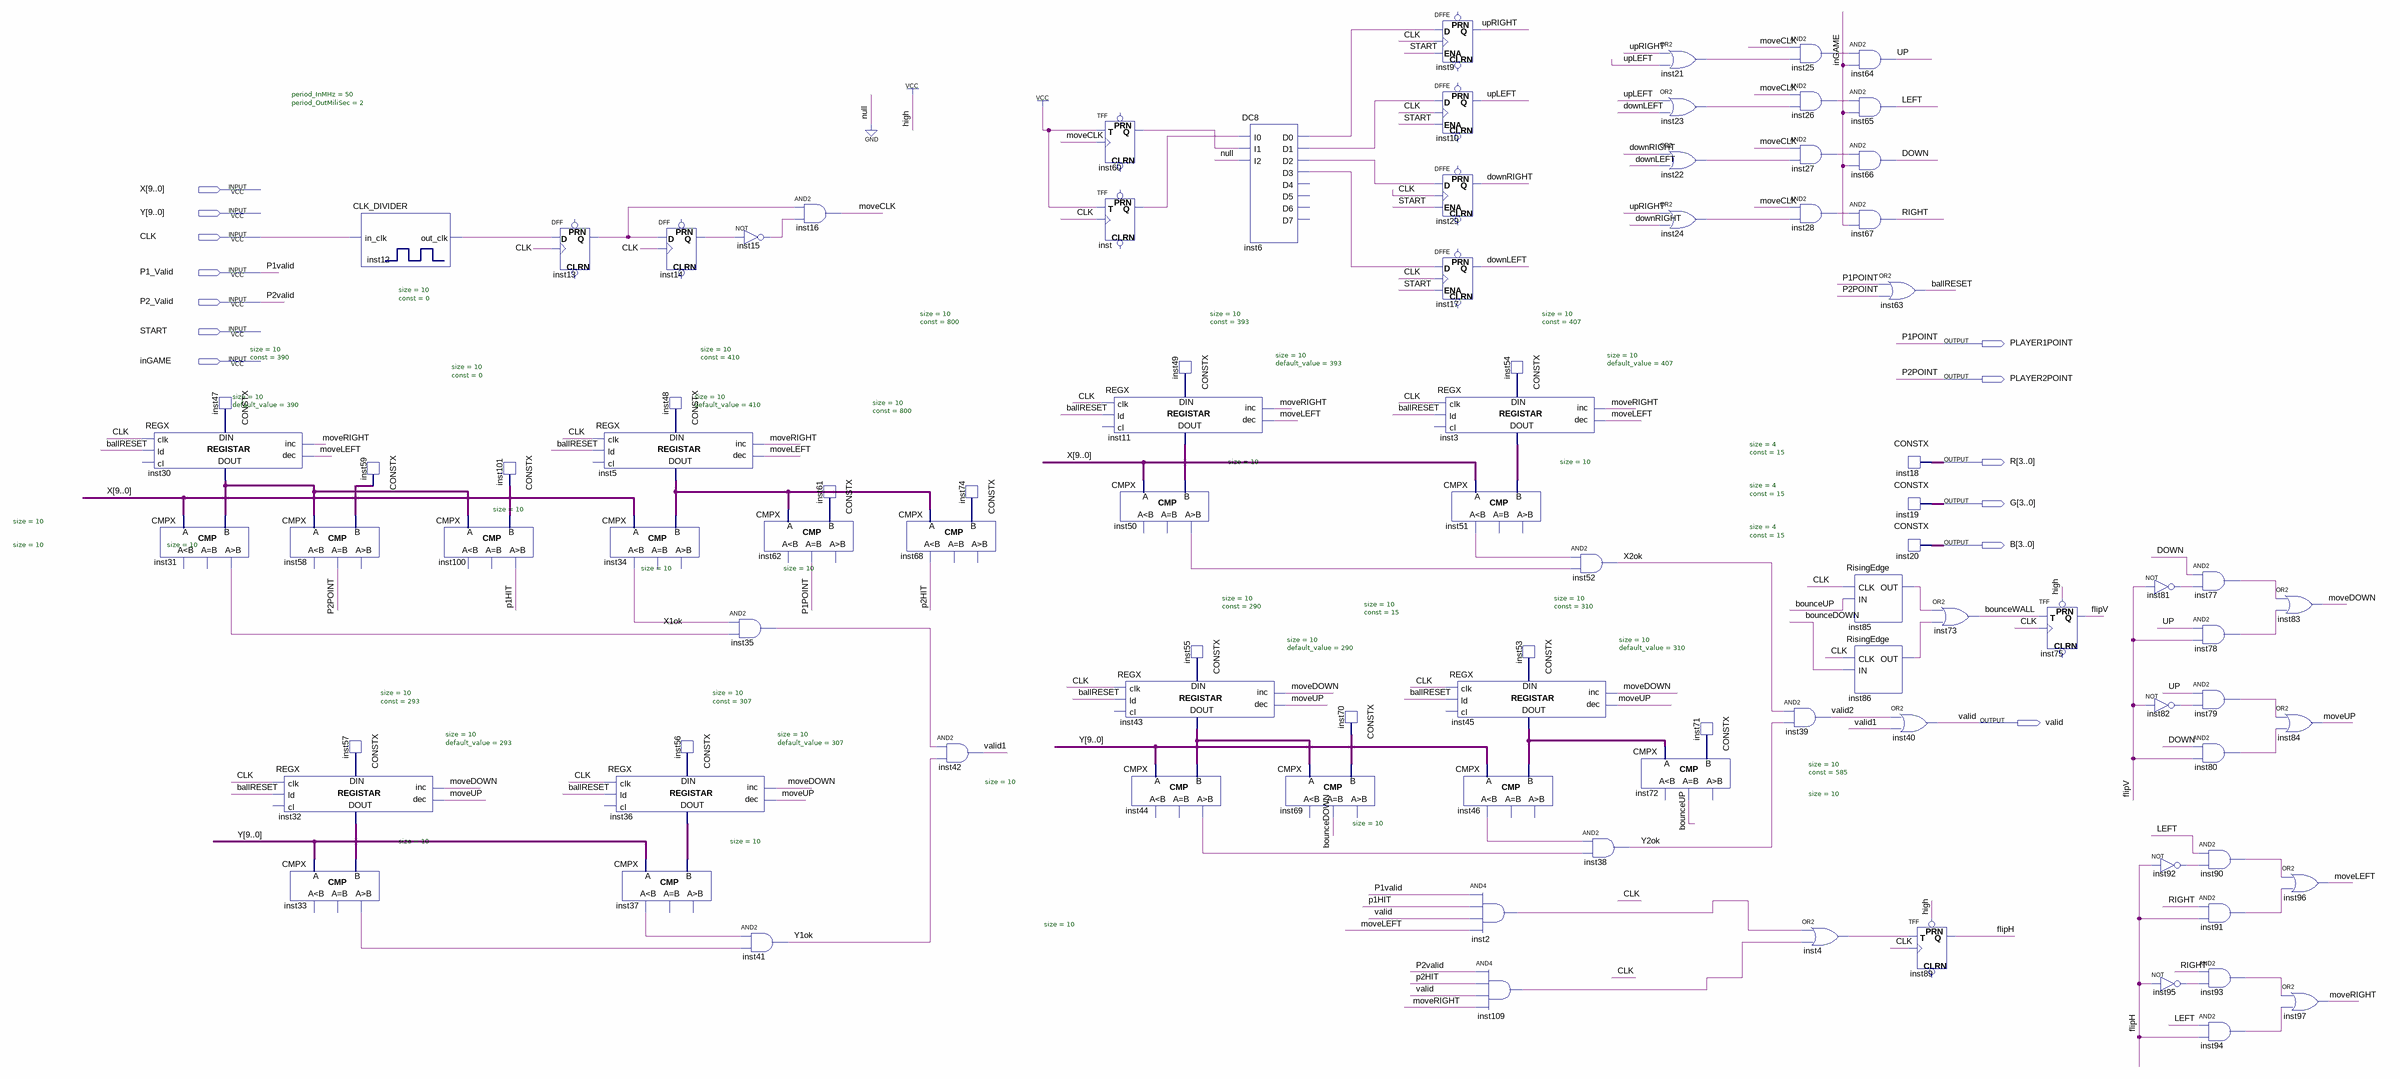
[diagram p0: schematic sheet]
// Quartus schematic Ball.bdf as structural Verilog: 95 symbols, 13 pins
module Ball (
  input  [9:0] X,
  input  [9:0] Y,
  input  CLK,
  input  P1_Valid,
  input  P2_Valid,
  input  START,
  input  inGAME,
  output PLAYER1POINT,
  output PLAYER2POINT,
  output [3:0] R,
  output [3:0] G,
  output [3:0] B,
  output valid
);

  wire ballRESET, bounceDOWN, bounceUP, bounceWALL, DOWN, downLEFT, downRIGHT, flipH, flipV, inst2_out,
       inst4_out, inst6_d0, inst6_d1, inst6_d2, inst6_d3, inst12_out_clk, inst13_q, inst14_q, inst15_out,
       inst21_out, inst22_out, inst23_out, inst24_out, inst25_out, inst26_out, inst27_out, inst28_out,
       inst31_gr, inst33_gr, inst34_ls, inst37_ls, inst44_gr, inst46_ls, inst50_gr, inst51_ls, inst60_q,
       inst77_out, inst78_out, inst79_out, inst80_out, inst81_out, inst82_out, inst85_out, inst86_out,
       inst90_out, inst91_out, inst92_out, inst93_out, inst94_out, inst95_out, inst109_out, inst_q, LEFT,
       moveCLK, moveDOWN, moveLEFT, moveRIGHT, moveUP, p1HIT, p2HIT, RIGHT, UP, upLEFT, upRIGHT, valid1,
       valid2, X1ok, X2ok, Y1ok, Y2ok;
  wire [9:0] inst3_data_out, inst5_data_out, inst11_data_out, inst30_data_out, inst32_data_out,
       inst36_data_out, inst43_data_out, inst45_data_out, inst47_data, inst48_data, inst49_data, inst53_data,
       inst54_data, inst55_data, inst56_data, inst57_data, inst59_data, inst61_data, inst70_data,
       inst71_data, inst74_data, inst101_data;

  REGX #(.size(10), .default_value(390)) inst30 (
    .clk(CLK), .ld(ballRESET), .inc(moveRIGHT), .dec(moveLEFT), .data_in(inst47_data),
    .data_out(inst30_data_out));  // open: cl
  CMPX #(.size(10)) inst31 (.A(X), .B(inst30_data_out), .gr(inst31_gr));  // open: ls, eq
  CONSTX #(.size(10), .\const (390)) inst47 (.data(inst47_data));
  CMPX #(.size(10)) inst58 (.A(inst30_data_out), .B(inst59_data), .eq(PLAYER2POINT));  // open: ls, gr
  REGX #(.size(10), .default_value(293)) inst32 (
    .clk(CLK), .ld(ballRESET), .inc(moveDOWN), .dec(moveUP), .data_in(inst57_data), .data_out(inst32_data_out));  // open: cl
  CMPX #(.size(10)) inst33 (.A(Y), .B(inst32_data_out), .gr(inst33_gr));  // open: ls, eq
  CLK_DIVIDER #(.period_InMHz(50), .period_OutMiliSec(2)) inst12 (.in_clk(CLK), .out_clk(inst12_out_clk));
  CONSTX #(.size(10), .\const (293)) inst57 (.data(inst57_data));
  CONSTX #(.size(10), .\const (0)) inst59 (.data(inst59_data));
  CMPX #(.size(10)) inst100 (.A(inst30_data_out), .B(inst101_data), .gr(p1HIT));  // open: ls, eq
  CONSTX #(.size(10), .\const (0)) inst101 (.data(inst101_data));
  DFF inst13 (.CLK(CLK), .D(inst12_out_clk), .Q(inst13_q));  // open: CLRN, PRN
  REGX #(.size(10), .default_value(410)) inst5 (
    .clk(CLK), .ld(ballRESET), .inc(moveRIGHT), .dec(moveLEFT), .data_in(inst48_data),
    .data_out(inst5_data_out));  // open: cl
  CMPX #(.size(10)) inst34 (.A(X), .B(inst5_data_out), .ls(inst34_ls));  // open: eq, gr
  REGX #(.size(10), .default_value(307)) inst36 (
    .clk(CLK), .ld(ballRESET), .inc(moveDOWN), .dec(moveUP), .data_in(inst56_data), .data_out(inst36_data_out));  // open: cl
  CMPX #(.size(10)) inst37 (.A(Y), .B(inst36_data_out), .ls(inst37_ls));  // open: eq, gr
  DFF inst14 (.CLK(CLK), .D(inst13_q), .Q(inst14_q));  // open: CLRN, PRN
  CONSTX #(.size(10), .\const (410)) inst48 (.data(inst48_data));
  CONSTX #(.size(10), .\const (307)) inst56 (.data(inst56_data));
  and inst35 (X1ok, inst34_ls, inst31_gr);
  not inst15 (inst15_out, inst14_q);
  CMPX #(.size(10)) inst62 (.A(inst5_data_out), .B(inst61_data), .eq(PLAYER1POINT));  // open: ls, gr
  and inst41 (Y1ok, inst37_ls, inst33_gr);
  and inst16 (moveCLK, inst13_q, inst15_out);
  CONSTX #(.size(10), .\const (800)) inst61 (.data(inst61_data));
  CMPX #(.size(10)) inst68 (.A(inst5_data_out), .B(inst74_data), .ls(p2HIT));  // open: eq, gr
  CONSTX #(.size(10), .\const (800)) inst74 (.data(inst74_data));
  and inst42 (valid1, X1ok, Y1ok);
  TFF inst60 (.T(1'b1), .CLK(moveCLK), .Q(inst60_q));  // open: PRN, CLRN
  TFF inst (.T(1'b1), .CLK(CLK), .Q(inst_q));  // open: PRN, CLRN
  REGX #(.size(10), .default_value(393)) inst11 (
    .clk(CLK), .ld(ballRESET), .inc(moveRIGHT), .dec(moveLEFT), .data_in(inst49_data),
    .data_out(inst11_data_out));  // open: cl
  CMPX #(.size(10)) inst50 (.A(X), .B(inst11_data_out), .gr(inst50_gr));  // open: ls, eq
  REGX #(.size(10), .default_value(290)) inst43 (
    .clk(CLK), .ld(ballRESET), .inc(moveDOWN), .dec(moveUP), .data_in(inst55_data), .data_out(inst43_data_out));  // open: cl
  CMPX #(.size(10)) inst44 (.A(Y), .B(inst43_data_out), .gr(inst44_gr));  // open: ls, eq
  CONSTX #(.size(10), .\const (393)) inst49 (.data(inst49_data));
  CONSTX #(.size(10), .\const (290)) inst55 (.data(inst55_data));
  DC8 inst6 (
    .I0(inst_q), .I1(inst60_q), .I2(1'b0), .D0(inst6_d0), .D1(inst6_d1), .D2(inst6_d2), .D3(inst6_d3));  // open: D4, D5, D6, D7
  CMPX #(.size(10)) inst69 (.A(inst43_data_out), .B(inst70_data), .eq(bounceDOWN));  // open: ls, gr
  CONSTX #(.size(10), .\const (15)) inst70 (.data(inst70_data));
  DFFE inst9 (.D(inst6_d0), .CLK(CLK), .ENA(START), .Q(upRIGHT));  // open: PRN, CLRN
  DFFE inst10 (.D(inst6_d1), .CLK(CLK), .ENA(START), .Q(upLEFT));  // open: PRN, CLRN
  DFFE inst29 (.D(inst6_d2), .CLK(CLK), .ENA(START), .Q(downRIGHT));  // open: PRN, CLRN
  DFFE inst17 (.D(inst6_d3), .CLK(CLK), .ENA(START), .Q(downLEFT));  // open: PRN, CLRN
  REGX #(.size(10), .default_value(407)) inst3 (
    .clk(CLK), .ld(ballRESET), .inc(moveRIGHT), .dec(moveLEFT), .data_in(inst54_data),
    .data_out(inst3_data_out));  // open: cl
  CMPX #(.size(10)) inst51 (.A(X), .B(inst3_data_out), .ls(inst51_ls));  // open: eq, gr
  REGX #(.size(10), .default_value(310)) inst45 (
    .clk(CLK), .ld(ballRESET), .inc(moveDOWN), .dec(moveUP), .data_in(inst53_data), .data_out(inst45_data_out));  // open: cl
  CMPX #(.size(10)) inst46 (.A(Y), .B(inst45_data_out), .ls(inst46_ls));  // open: eq, gr
  and inst2 (inst2_out, P1_Valid, p1HIT, valid, moveLEFT);
  and inst109 (inst109_out, P2_Valid, p2HIT, valid, moveRIGHT);
  CONSTX #(.size(10), .\const (407)) inst54 (.data(inst54_data));
  CONSTX #(.size(10), .\const (310)) inst53 (.data(inst53_data));
  and inst52 (X2ok, inst51_ls, inst50_gr);
  and inst38 (Y2ok, inst46_ls, inst44_gr);
  CMPX #(.size(10)) inst72 (.A(inst45_data_out), .B(inst71_data), .eq(bounceUP));  // open: ls, gr
  or inst21 (inst21_out, upRIGHT, upLEFT);
  or inst23 (inst23_out, upLEFT, downLEFT);
  or inst22 (inst22_out, downRIGHT, downLEFT);
  or inst24 (inst24_out, upRIGHT, downRIGHT);
  CONSTX #(.size(10), .\const (585)) inst71 (.data(inst71_data));
  and inst25 (inst25_out, moveCLK, inst21_out);
  and inst26 (inst26_out, moveCLK, inst23_out);
  and inst27 (inst27_out, moveCLK, inst22_out);
  and inst28 (inst28_out, moveCLK, inst24_out);
  and inst39 (valid2, X2ok, Y2ok);
  or inst4 (inst4_out, inst2_out, inst109_out);
  and inst64 (UP, inst25_out, inGAME);
  and inst65 (LEFT, inst26_out, inGAME);
  and inst66 (DOWN, inst27_out, inGAME);
  and inst67 (RIGHT, inst28_out, inGAME);
  RisingEdge inst85 (.CLK(CLK), .IN(bounceUP), .OUT(inst85_out));
  RisingEdge inst86 (.CLK(CLK), .IN(bounceDOWN), .OUT(inst86_out));
  or inst63 (ballRESET, PLAYER1POINT, PLAYER2POINT);
  CONSTX #(.size(4), .\const (15)) inst18 (.data(R));
  CONSTX #(.size(4), .\const (15)) inst19 (.data(G));
  CONSTX #(.size(4), .\const (15)) inst20 (.data(B));
  or inst40 (valid, valid2, valid1);
  TFF inst89 (.PRN(1'b1), .T(inst4_out), .CLK(CLK), .Q(flipH));  // open: CLRN
  or inst73 (bounceWALL, inst85_out, inst86_out);
  TFF inst75 (.PRN(1'b1), .T(bounceWALL), .CLK(CLK), .Q(flipV));  // open: CLRN
  not inst81 (inst81_out, flipV);
  not inst82 (inst82_out, flipV);
  not inst92 (inst92_out, flipH);
  not inst95 (inst95_out, flipH);
  and inst77 (inst77_out, DOWN, inst81_out);
  and inst78 (inst78_out, UP, flipV);
  and inst79 (inst79_out, UP, inst82_out);
  and inst80 (inst80_out, DOWN, flipV);
  and inst90 (inst90_out, LEFT, inst92_out);
  and inst91 (inst91_out, RIGHT, flipH);
  and inst93 (inst93_out, RIGHT, inst95_out);
  and inst94 (inst94_out, LEFT, flipH);
  or inst83 (moveDOWN, inst77_out, inst78_out);
  or inst84 (moveUP, inst79_out, inst80_out);
  or inst96 (moveLEFT, inst90_out, inst91_out);
  or inst97 (moveRIGHT, inst93_out, inst94_out);

  // Other names for the same wires on the sheet: P1POINT = PLAYER1POINT; P1valid = P1_Valid; P2POINT = PLAYER2POINT;
  //   P2valid = P2_Valid
endmodule
